# EAGLE design openSX70-FPC-breakout-5P-SEED (EAGLE 8.6.3)
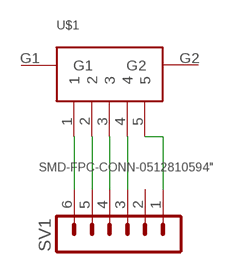
[diagram p0: schematic, sheet 1]

## Parts
SV1  MA06-1  [MA06-1]
U$1  SMD-FPC-CONN-0512810594"  [51281-0594]

## Nets
N$1: SV1.6 U$1.1
N$2: SV1.5 U$1.2
N$3: SV1.4 U$1.3
N$4: SV1.3 U$1.4
N$5: SV1.1 U$1.5
Unconnected: SV1.2 U$1.G1 U$1.G2

## Library data of the parts
SV1 = con-lstb:MA06-1: PIN HEADER; OC_FARNELL: unknown; OC_NEWARK: unknown
U$1 = Seeed-OPL-2017-01-connector-edward:SMD-FPC-CONN-0512810594: 320060184

## Net classes
0 default: width 0.254 mm, drill 0.33 mm, clearance 0.152 mm

## Board
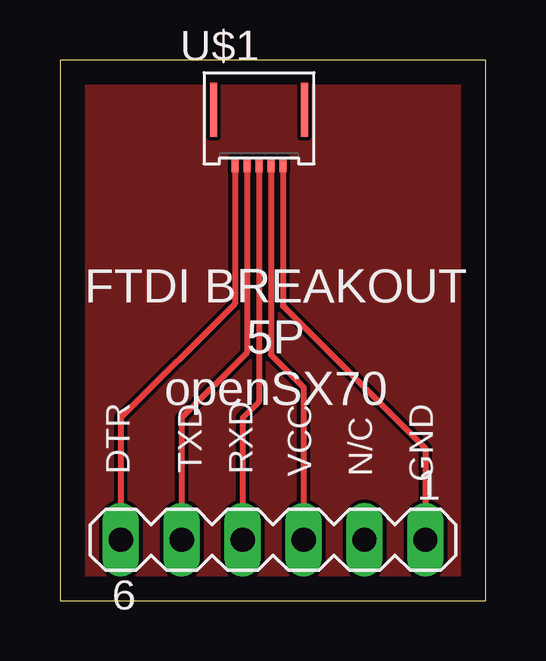
[diagram p1: board, top side]
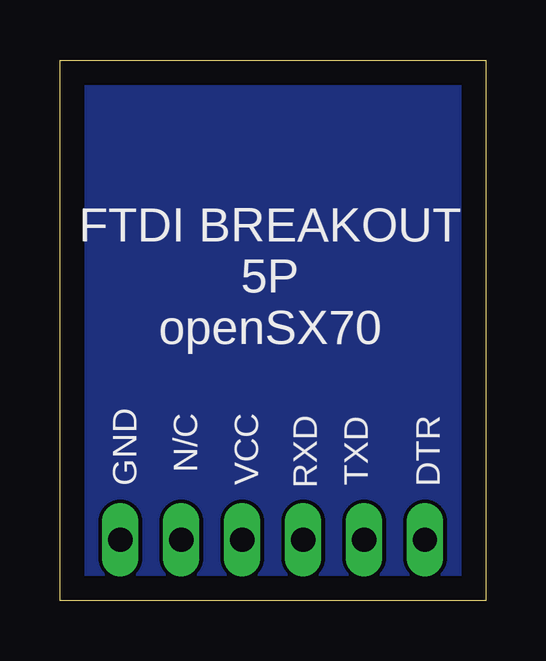
[diagram p2: board, bottom side, seen from below]

Size 17.76 x 22.53 mm. Coordinates in mm from the lower left corner, seen from the top.
Outline: 0,0 17.76,0 17.76,22.53 0,22.53 0,0
Copper layers (1*16): Top 0.035mm / dielectric 1.5mm / Bottom 0.035mm
Design rules "default": minimum track width 6mil, minimum drill 0.35mm, track to track 6mil, track to pad 6mil, pad to pad 6mil, via to via 6mil, smd to smd 6mil, copper to edge 40mil, drill to drill 6mil, minimum pad ring 10mil, minimum via ring 8mil, stop-mask expansion 4mil, vias tented up to drill 0mil, thermal gap 10mil

### Footprints (pad centres in the part's own frame; a part is rotated, then mirrored left to right if it is on the bottom)
MA06-1 = drill 1.016 long: 1 -6.35,0; 2 -3.81,0; 3 -1.27,0; 4 1.27,0; 5 3.81,0; 6 6.35,0
51281-0594 = smd 0.305 x 0.61: 1 1.3,-3.85; 2 1.8,-3.85; 3 2.3,-3.85; 4 2.8,-3.85; 5 3.3,-3.85 | smd 0.3 x 2.25: G1 0.4,-1.55; G2 4.2,-1.55

### Placement (x,y rotation side)
SV1  8.89,2.54 180 top
U$1  6,22 0 top

### Tracks (layer width: path | path; a pad name or v marks a point on that pad's centre or on a via)
GND
  pour Top: 0.05,22.55 17.98,22.48 18,0 0,0
  pour Bottom: 0,22 17,22 17,0 0,0
N$1
  Top 0.254: U$1.1 7.3,12.38 2.54,7.62 SV1.6
N$2
  Top 0.254: U$1.2 7.8,10.34 5.08,7.62 SV1.5
N$3
  Top 0.254: U$1.3 8.3,8.3 7.62,7.62 SV1.4
N$4
  Top 0.254: U$1.4 8.8,10.25 10.16,8.89 SV1.3
N$5
  Top 0.254: U$1.5 9.3,12.29 15.24,6.35 SV1.1

### Text on the board
tPlace: FTDI BREAKOUT / 5P / openSX70 | DTR | TXD | RXD | VCC | N/C | GND
bPlace: FTDI BREAKOUT / 5P / openSX70 | DTR | TXD | RXD | VCC | N/C | GND